# Altium schematic sheet Top.SchDoc: StepMotor Controller
size A4; Organization: NTUST EE-305; Address1: No.43, Sec. 4, Keelung Rd.; Address2: Da’an Dist.; Address3: Taipei 106; Address4: Taiwan (R.O.C.); DocumentNumber: 1; Revision: 1.0; SheetNumber: 1; SheetTotal: 8
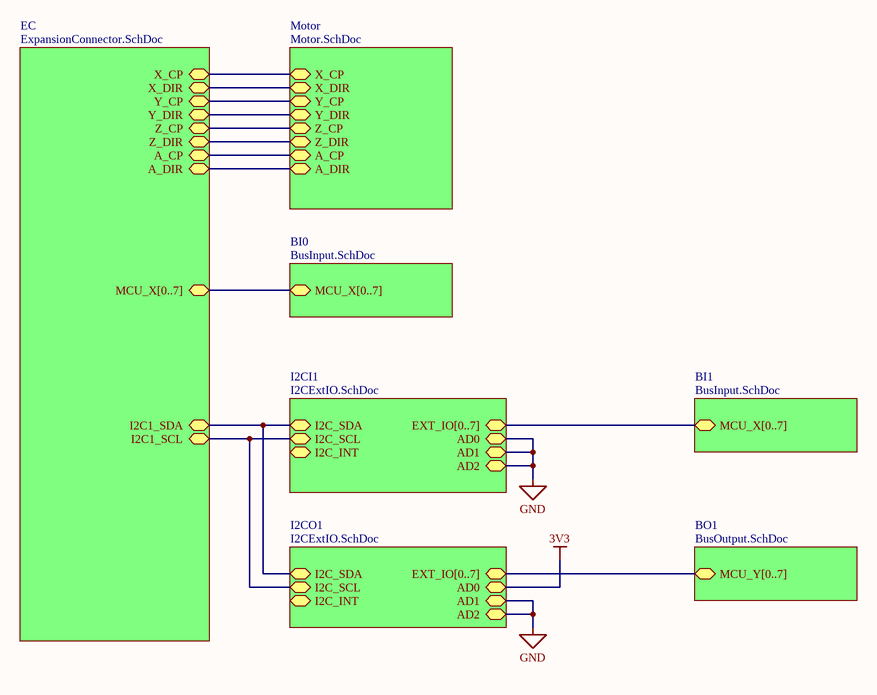
[diagram p0: Top.SchDoc]

## Sub-sheets
BI0 = BusInput.SchDoc: MCU_X[0..7]
BI1 = BusInput.SchDoc: MCU_X[0..7]
BO1 = BusOutput.SchDoc: MCU_Y[0..7]
EC = ExpansionConnector.SchDoc: X_CP, X_DIR, Y_CP, Y_DIR, Z_CP, Z_DIR, A_CP, A_DIR, MCU_X[0..7], I2C1_SCL, I2C1_SDA
I2CI1 = I2CExtIO.SchDoc: EXT_IO[0..7], I2C_SCL, I2C_SDA, I2C_INT, AD0, AD1, AD2
I2CO1 = I2CExtIO.SchDoc: EXT_IO[0..7], I2C_SCL, I2C_SDA, I2C_INT, AD0, AD1, AD2
Motor = Motor.SchDoc: X_CP, X_DIR, Y_CP, Y_DIR, Z_CP, Z_DIR, A_CP, A_DIR

## Nets
3V3: sheet I2CO1/AD0
GND: sheet I2CI1/AD0, sheet I2CI1/AD1, sheet I2CI1/AD2, sheet I2CO1/AD1, sheet I2CO1/AD2
(unnamed): sheet EC/X_CP, sheet Motor/X_CP
(unnamed): sheet EC/X_DIR, sheet Motor/X_DIR
(unnamed): sheet EC/Y_CP, sheet Motor/Y_CP
(unnamed): sheet EC/Y_DIR, sheet Motor/Y_DIR
(unnamed): sheet EC/Z_CP, sheet Motor/Z_CP
(unnamed): sheet EC/Z_DIR, sheet Motor/Z_DIR
(unnamed): sheet EC/A_CP, sheet Motor/A_CP
(unnamed): sheet EC/A_DIR, sheet Motor/A_DIR
(unnamed): sheet EC/I2C1_SCL, sheet I2CI1/I2C_SCL, sheet I2CO1/I2C_SCL
(unnamed): sheet EC/I2C1_SDA, sheet I2CI1/I2C_SDA, sheet I2CO1/I2C_SDA

## Buses and harness runs
bus sheet BI0/MCU_X[0..7] = sheet EC/MCU_X[0..7]
bus sheet BI1/MCU_X[0..7] = sheet I2CI1/EXT_IO[0..7]
bus sheet BO1/MCU_Y[0..7] = sheet I2CO1/EXT_IO[0..7]

## Notes on the sheet
- Title
- Name
- Size:
- Revision:
- A4
- Date:
- Time:
- Sheet
- of